# EAGLE design Breadboard Power Supply (1) (EAGLE 7.4.0)
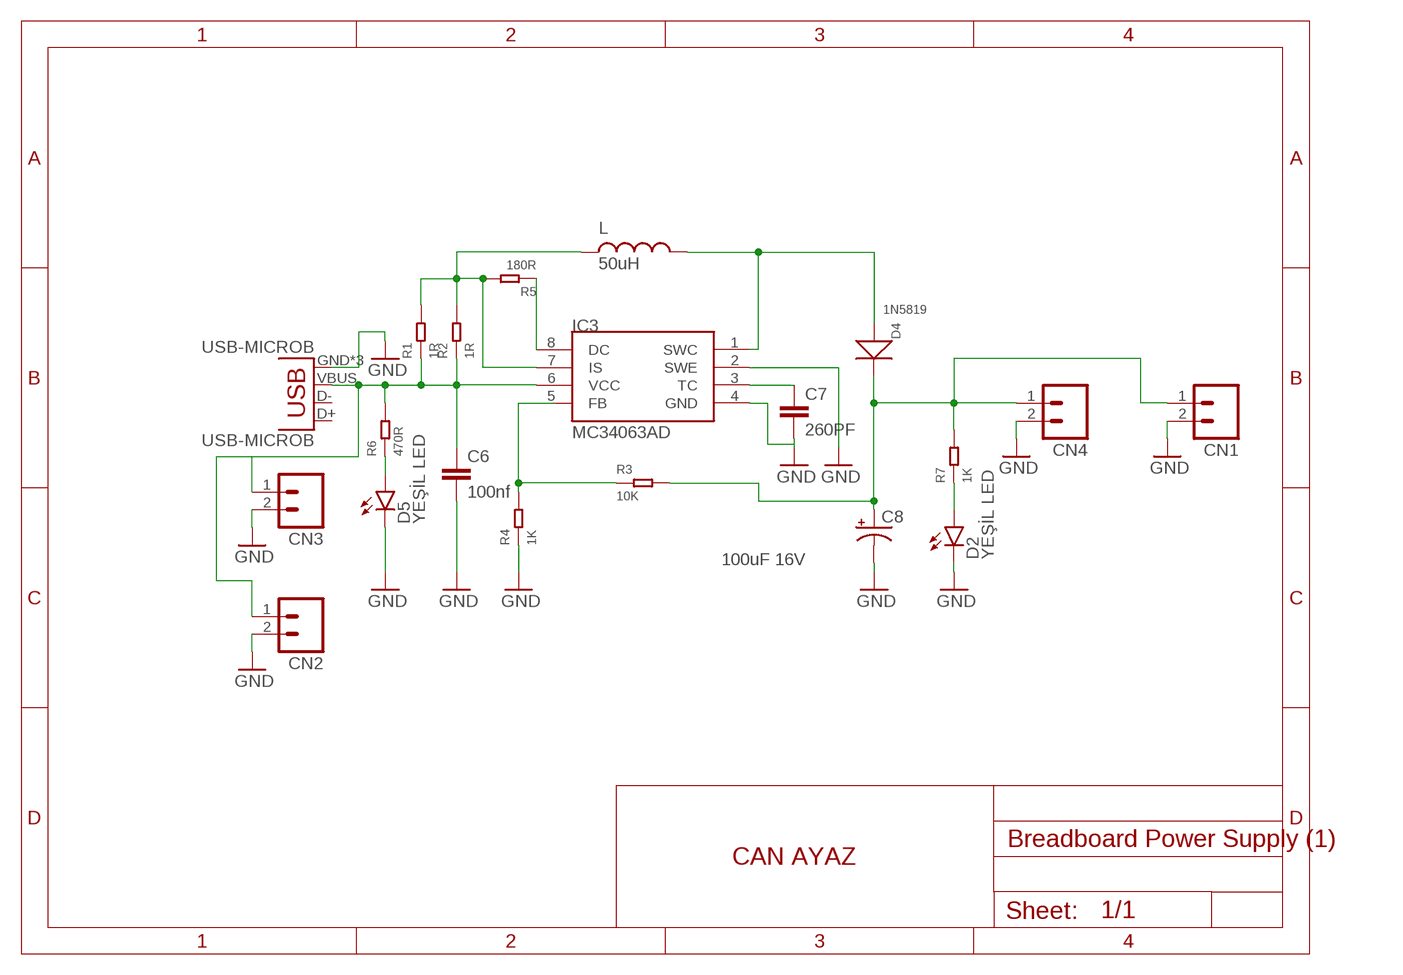
[diagram p0: schematic, sheet 1]

## Parts
C6  100nf  CAP1206  [1206]
C7  260PF  CAP1206  [1206]
C8  100uF 16V  CAP_POLG  [PANASONIC_G]
CN1  M02  [02P]
CN2  M02  [02P]
CN3  M02  [02P]
CN4  M02  [02P]
D2  YEŞİL LED  LED1206  [LED-1206]
D4  1N5819  DIODE'SMA'  [DO-214AC]
D5  YEŞİL LED  LED1206  [LED-1206]
IC3  MC34063AD  [SOIC8]
L  50uH  MSS1260  [MSS1260]
R1  1R  RES-1206  [R1206]
R2  1R  RES-1206  [R1206]
R3  10K  RES-1206  [R1206]
R4  1K  RES-1206  [R1206]
R5  180R  RES-1206  [R1206]
R6  470R  RES-1206  [R1206]
R7  1K  RES-1206  [R1206]
USB-MICROB  USB-MICROB  [USB-MICROB]

## Nets
GND: C6.2 C7.2 C8.- CN1.2 CN2.2 CN3.2 CN4.2 D2.C D5.C IC3.2(SWE) IC3.4(GND) R4.1 USB-MICROB.GND USB-MICROB.MT1(GND) USB-MICROB.MT2(GND)
N$1: C8.+ CN1.1 CN4.1 D4.2(-) R3.2 R7.2
N$2: C6.1 CN2.1 CN3.1 IC3.6(VCC) R1.1 R2.1 R6.2 USB-MICROB.VBUS
N$3: IC3.5(FB) R3.1 R4.2
N$5: IC3.7(IS) L.P$2 R1.2 R2.2 R5.2
N$6: IC3.8(DC) R5.1
N$7: D4.1(+) IC3.1(SWC) L.P$1
N$8: C7.1 IC3.3(TC)
N$9: D2.A R7.1
N$11: D5.A R6.1
Unconnected: USB-MICROB.D+ USB-MICROB.D-

## Notes on the sheet
- CAN AYAZ

## Library data of the parts
C6 C7 = SparkFun-Capacitors:CAP: Capacitor Standard 0603 ceramic capacitor, and 0.1" leaded capacitor.
C8 = SparkFun-Capacitors:CAP_POL: Capacitor Polarized These are standard SMD and PTH capacitors. Normally 10uF, 47uF, and 100uF in electrolytic and tantalum varieties. Always verify the external diameter of the through hole cap, it varies with capacity, voltage, and manufacturer. The EIA devices should be standard.
CN1-CN4 = con-amp-quick:M02: AMP QUICK CONNECTOR; OC_FARNELL: unknown; OC_NEWARK: unknown
D2 D5 = SparkFun-LED:LED: LEDs Standard schematic elements and footprints for 5mm, 3mm, 1206, and 0603 sized LEDs. 5mm - Spark Fun Electronics SKU : COM-00529 (and others)
D4 = Seeed-OPL-Diode:DIODE*
IC3 = mc34063:MC34063
L = inductor-coilcraft:MSS1260: SMT Power Inductor
R1-R7 = Seeed-OPL-Resistor:RES
USB-MICROB = SparkFun-Connectors:USB: USB Connectors USB-B-PTH is fully proven SKU : PRT-00139/CONN-08278 USB-miniB is fully proven SKU : PRT-00587 USB-A-PCB is untested. USB-A-H is throughly reviewed, but untested. Spark Fun Electronics SKU : PRT-00437 USB-B-SMT is throughly reviewed, but untested. Needs silkscreen touching up. USB-A-S has not been used/tested USB-MB-H has not been used/tested USB-MICROB has been used. CONN-09505; PROD_ID: CONN-09505

## Board
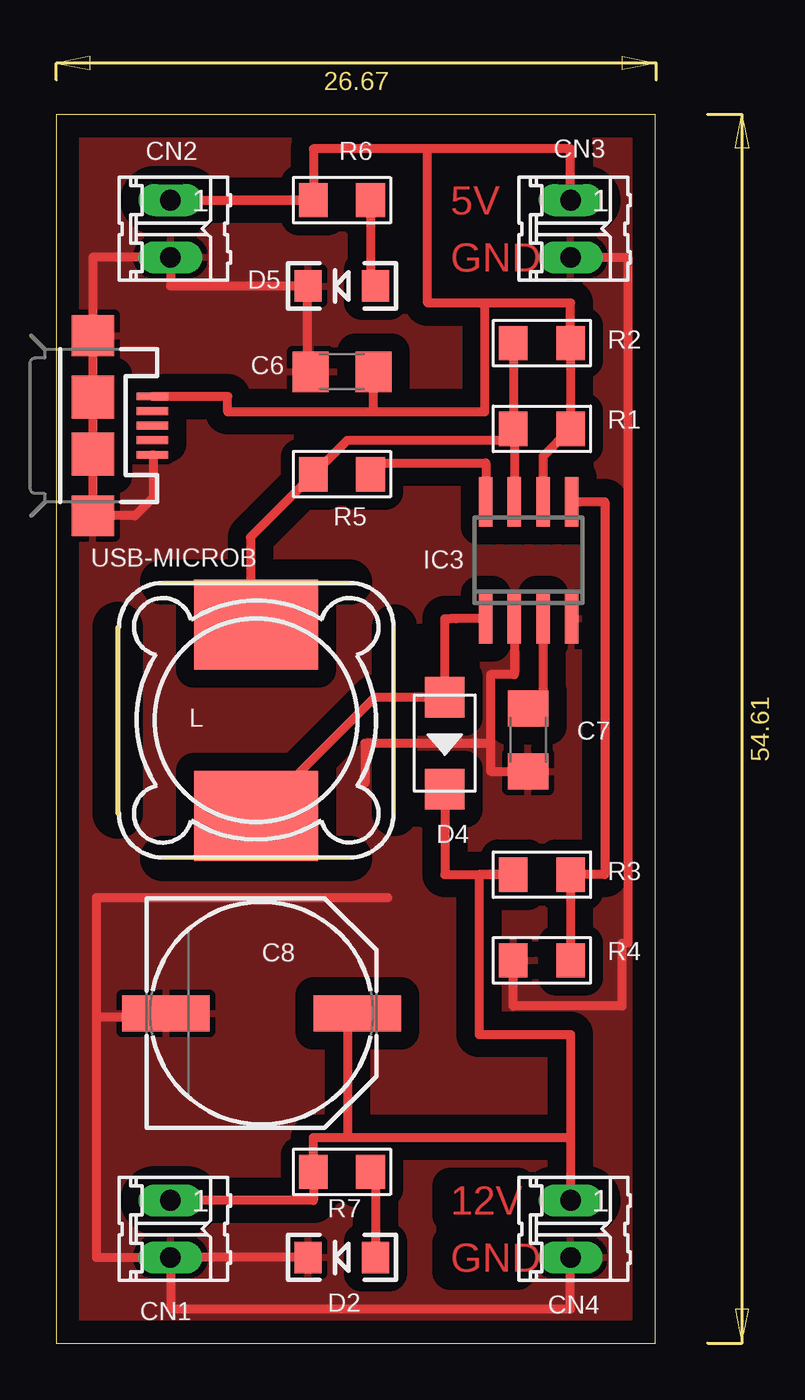
[diagram p1: board, top side]

Size 26.64 x 54.6 mm. Coordinates in mm from the lower left corner, seen from the top.
Outline: 0,0 26.64,0 26.64,54.6 0,54.6 0,0
Copper layers (1*16): Top 0.035mm / dielectric 1.5mm / Bottom 0.035mm
Design rules "default": minimum track width 10mil, minimum drill 24mil, track to track 8mil, track to pad 8mil, pad to pad 8mil, via to via 8mil, smd to smd 8mil, copper to edge 40mil, drill to drill 8mil, minimum pad ring 10mil, minimum via ring 8mil, stop-mask expansion 4mil, vias tented up to drill 0mil, thermal gap 10mil

### Footprints (pad centres in the part's own frame; a part is rotated, then mirrored left to right if it is on the bottom)
1206 = smd 1.6 x 1.8: 1 -1.4,0; 2 1.4,0
PANASONIC_G = smd 3.9 x 1.6: + 4.25,0; - -4.25,0
02P = drill 0.914 long: 1 -1.27,0; 2 1.27,0
LED-1206 = smd 1.2 x 1.4: A -1.5,0; C 1.5,0
DO-214AC = smd 1.8 x 1.77: 1 -2.042,0; 2 2.042,0
SOIC8 = smd 0.6 x 2.2: 1 -1.905,-2.6; 2 -0.635,-2.6; 3 0.635,-2.6; 4 1.905,-2.6; 5 1.905,2.6; 6 0.635,2.6; 7 -0.635,2.6; 8 -1.905,2.6
MSS1260 = smd 5.5 x 4: P$1 0,4.25; P$2 0,-4.25
R1206 = smd 1.27 x 1.524: 1 -1.27,0; 2 1.27,0
USB-MICROB = smd 0.35 x 1.4: D+ 0,2.65; D- -0.65,2.65; GND 1.3,2.65; ID 0.65,2.65; VBUS -1.3,2.65 | smd 1.8 x 1.9: MT1 -4,0; MT2 4,0 | smd 1.9 x 1.9: P$1 -1.27,0; P$2 1.27,0

### Placement (x,y rotation side)
C6  12.7,43.18 180 top
C7  20.98,26.81 270 top
C8  9.13,14.67 0 top
CN1  5.08,5.08 270 top
CN2  5.08,49.53 270 top
CN3  22.86,49.53 270 top
CN4  22.86,5.08 270 top
D2  12.7,3.81 180 top
D4  17.27,26.67 270 top
D5  12.7,46.99 180 top
IC3  21,34.8 0 top
L  8.89,27.69 180 top
R1  21.59,40.64 180 top
R2  21.59,44.45 180 top
R3  21.59,20.83 180 top
R4  21.59,17.02 0 top
R5  12.7,38.62 180 top
R6  12.7,50.8 180 top
R7  12.7,7.62 180 top
USB-MICROB  1.63,40.78 270 top

### Tracks (layer width: path | path; a pad name or v marks a point on that pad's centre or on a via)
GND
  Top 0.406: IC3.2 20.36,29.72 19.3,29.72 19.3,26.67 | 19.3,26.67 19.3,25.41 C7.2 | 14.73,19.81 1.78,19.81 1.78,14.48 | 19.3,26.67 13.72,26.67 13.72,24.89 | D2.C CN1.2 | CN1.2 5.08,1.52 22.86,1.52 CN4.2 | 1.78,14.48 1.78,3.81 CN1.2 | C6.2 11.18,43.18 11.18,47.24 arc-90 11.2,47.22 D5.C 5.08,46.99 CN2.2 1.63,48.26 USB-MICROB.MT1 USB-MICROB.MT2 | C8.- arc-90 4.69,14.48 1.78,14.48 | 1.78,36.78 USB-MICROB.MT2 | USB-MICROB.GND 4.32,39.48 4.32,37.59 3.51,36.78 USB-MICROB.MT2 | CN3.2 25.4,48.26 25.4,17.78 25.15,17.78 25.15,14.99 20.32,14.99 R4.1
  pour Top (isolate 0.813): 0.25,54.36 26.42,54.36 26.42,0.25 0.25,0.25
N$1
  Top 0.406: 22.86,9.14 22.86,13.72 18.8,13.72 18.8,20.83 R3.2 17.27,20.83 D4.2 | 22.86,9.14 CN4.1 | CN1.1 11.43,6.35 R7.2 11.43,9.14 12.95,9.14 | 12.95,9.14 22.86,9.14 | C8.+ 12.95,14.16 12.95,9.14
N$2
  Top 0.406: CN2.1 R6.2 | R6.2 7.58,50.8 | IC3.6 21.64,39.41 R1.1 R2.1 22.86,46.23 19.05,46.23 | 19.05,46.23 16.51,46.23 16.51,53.09 | USB-MICROB.VBUS 7.62,42.08 7.62,41.4 14.1,41.4 | 16.51,53.09 11.43,53.09 R6.2 | 14.1,41.4 C6.1 | CN3.1 22.86,53.09 16.51,53.09 | 14.1,41.4 19.05,41.4 19.05,46.23
N$3
  Top 0.406: IC3.5 24.38,37.4 24.38,20.83 R3.1 R4.2
N$5
  Top 0.406: R2.2 R1.2 20.36,40.64 20.36,40.13 | 20.36,40.13 IC3.7 | L.P$2 8.89,31.5 8.64,31.24 8.64,35.83 R5.2 12.94,40.13 20.36,40.13
N$6
  Top 0.406: R5.1 14.46,39.12 19.09,39.12 IC3.8
N$7
  Top 0.406: 6.85,22.93 L.P$1 14.17,28.71 D4.1 17.27,32.2 17.53,32.2 17.78,32.2 IC3.1
N$8
  Top 0.254: 21.64,28.87 20.98,28.87 C7.1
  Top 0.406: IC3.3 21.64,28.87
N$9
  Top 0.406: R7.1 14.2,7.62 D2.A
N$11
  Top 0.406: R6.1 13.97,46.99 D5.A

### Text on the board
Top: 5V | GND | 12V | GND